# Altium schematic sheet DACModule.SchDoc
size A4; Date: 07.06.2021; Author: Mateusz Mróz; CompanyName: AGH; SheetNumber: 5; SheetTotal: 5
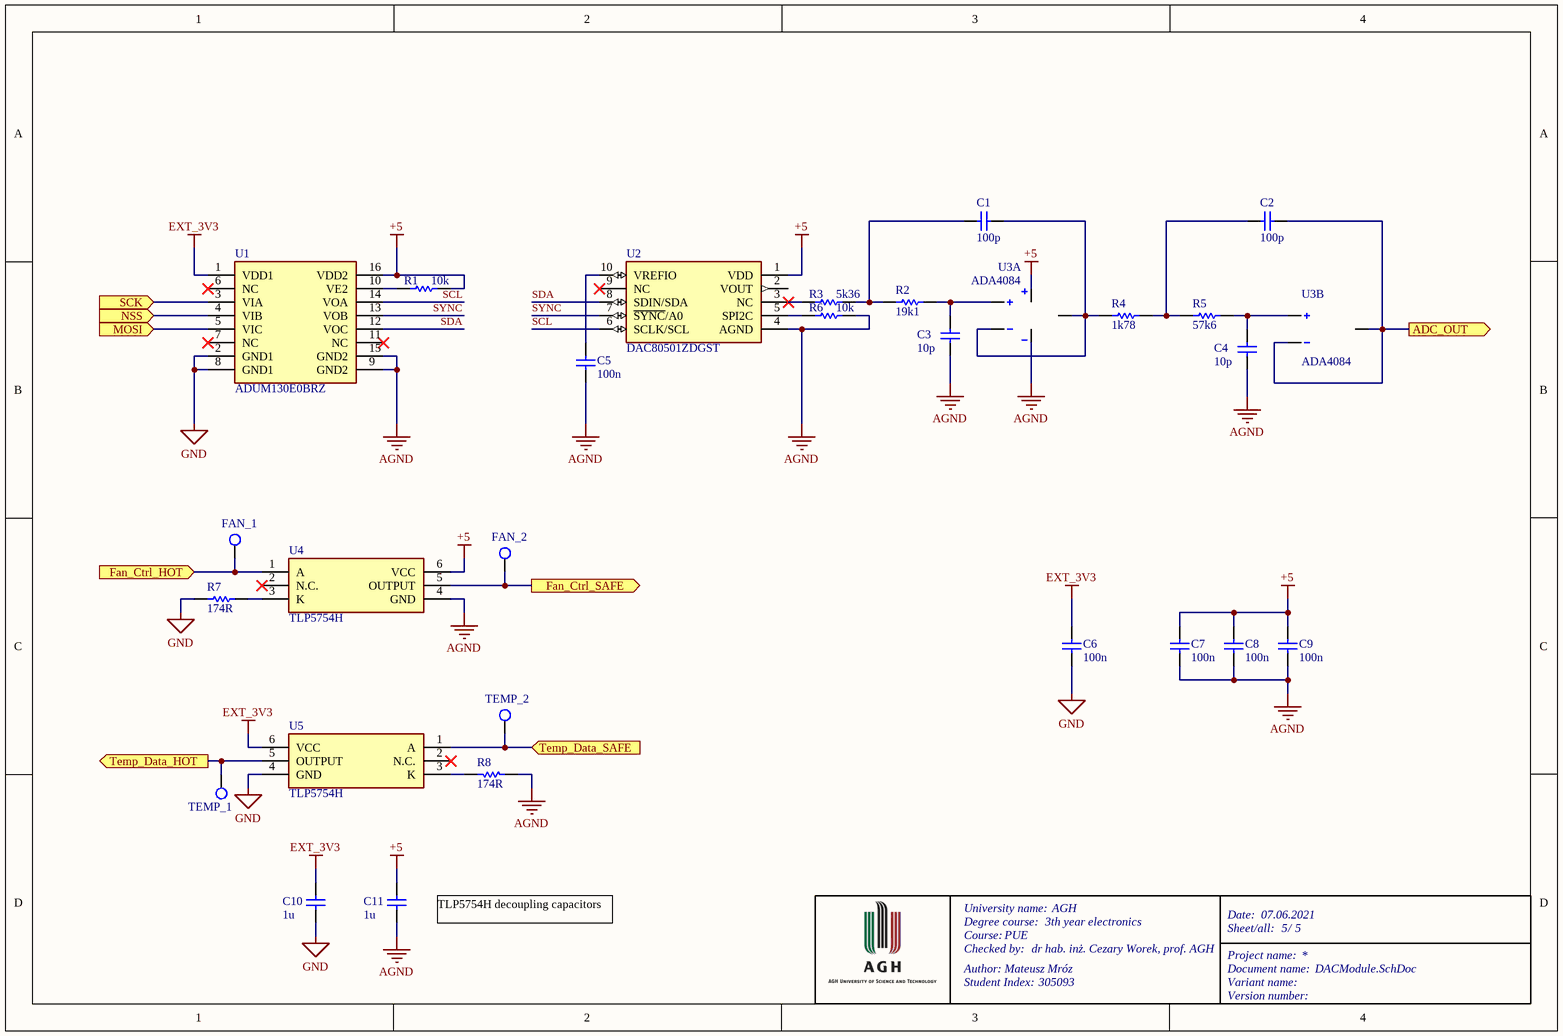
[diagram p0: DACModule.SchDoc]

## Parts
C1  100p  [Cap_0603_MD_outline]
C2  100p  [Cap_0603_MD_outline]
C3  10p  [Cap_0603_MD_outline]
C4  10p  [Cap_0603_MD_outline]
C5  100n  [Cap_0603_MD_outline]
C6  100n  [Cap_0603_MD_outline]
C7  100n  [Cap_0603_MD_outline]
C8  100n  [Cap_0603_MD_outline]
C9  100n  [Cap_0603_MD_outline]
C10  1u  [Cap_0805_MD_outline]
C11  1u  [Cap_0805_MD_outline]
R1  10k  [Res_0603_MD_outline]
R2  19k1  [Res_0603_MD_outline]
R3  5k36  [Res_0603_MD_outline]
R4  1k78  [Res_0603_MD_outline]
R5  57k6  [Res_0603_MD_outline]
R6  10k  [Res_0603_MD_outline]
R7  174R  [Res_0603_MD_outline]
R8  174R  [Res_0603_MD_outline]
TP1  FAN_1  [TP_SQ40]  (no BOM)
TP2  FAN_2  [TP_SQ40]  (no BOM)
TP3  TEMP_1  [TP_SQ40]  (no BOM)
TP4  TEMP_2  [TP_SQ40]  (no BOM)
U1  ADUM130E0BRZ  [SOIC127P600X175-16N]
U2  DAC80501ZDGST  [SOP50P490X110-10N]
U3  ADA4084  [SON50P300X300X85-9N-D]  (parts A,B,C of 3)
U4  TLP5754H  [SOIC127P1000X230-6N]
U5  TLP5754H  [SOIC127P1000X230-6N]

## Ports
ADC_OUT (out), Fan_Ctrl_HOT (in), Fan_Ctrl_SAFE (out), MOSI (in), NSS (in), SCK (in), Temp_Data_HOT (out), Temp_Data_SAFE (in)

## Nets
+5: C7.2 C8.2 C9.2 C11.2 R1.1 U1.16(VDD2) U2.1(VDD) U3.8(V+) U4.6(VCC)
AGND: C3.1 C4.1 C5.1 C7.1 C8.1 C9.1 C11.1 R6.1 R8.1 U1.9(GND2) U1.15(GND2) U2.4(AGND) U3.4(V-) U4.4(GND)
EXT_3V3: C6.2 C10.2 U1.1(VDD1) U5.6(VCC)
GND: C6.1 C10.1 R7.1 U1.2(GND1) U1.8(GND1) U5.4(GND)
ADC_OUT: C2.1 U3.6(-IN_B) U3.7(OUT_B) ; port ADC_OUT
Fan_Ctrl_HOT: TP1.1 U4.1(A) ; port Fan_Ctrl_HOT
Fan_Ctrl_SAFE: TP2.1 U4.5(OUTPUT) ; port Fan_Ctrl_SAFE
MOSI: U1.5(VIC) ; port MOSI
NSS: U1.4(VIB) ; port NSS
SCK: U1.3(VIA) ; port SCK
SCL: U1.14(VOA) U2.6(SCLK/SCL)
SDA: U1.12(VOC) U2.8(SDIN/SDA)
SYNC: U1.13(VOB) U2.7(~{SYNC}/A0)
Temp_Data_HOT: TP3.1 U5.5(OUTPUT) ; port Temp_Data_HOT
Temp_Data_SAFE: TP4.1 U5.1(A) ; port Temp_Data_SAFE
NetC1_1: C1.1 R4.1 U3.1(OUT_A) U3.2(-IN_A)
NetC1_2: C1.2 R2.1 R3.1
NetC2_2: C2.2 R4.2 R5.1
NetC3_2: C3.2 R2.2 U3.3(+IN_A)
NetC4_2: C4.2 R5.2 U3.5(+IN_B)
NetC5_2: C5.2 U2.10(VREFIO)
NetR1_2: R1.2 U1.10(VE2)
NetR3_2: R3.2 U2.3(NC)
NetR6_2: R6.2 U2.5(SPI2C)
NetR7_2: R7.2 U4.3(K)
NetR8_2: R8.2 U5.3(K)

Not connected (* = marked no-connect by the designer): U1 6(NC)* 7(NC)* 11(NC)*; U2 2(VOUT) 9(NC)*; U4 2(N.C.)*; U5 2(N.C.)*

## Notes on the sheet
- (near C11) TLP5754H decoupling capacitors
- University name:
- Degree course:
- 3th year electronics
- Date:
- Author:
- Student Index:
- Course:
- Checked by:
- PUE
- dr hab. inż. Cezary Worek, prof. AGH
- 305093
- Project name:
- Document name:
- Variant name:
- Sheet/all:
- /
- Version number:

## Library data of the parts
C1 C2 = Capacitor: MPN: GQM1875C2E101JB12D; Value: 100p; Package: 0603
C3 C4 = Capacitor: MPN: GRM1885C2E100JW07D; Value: 10p; Package: 0603
C5-C9 = Capacitor: MPN: GRM188R72A104KA35; Value: 100n; Package: 0603
C10 C11 = Capacitor: MPN: GRM219R7YA105KA12; Value: 1u; Package: 0805
R1 R6 = Resistor: MPN: CRCW060310K0FKEAC; Value: 10k; Package: 0603
R2 = Resistor: MPN: CRCW060319K1FKTA; Value: 19k1; Package: 0603
R3 = Resistor: MPN: CRCW06035K36FKEA; Value: 5k36; Package: 0603
R4 = Resistor: MPN: CRCW06031K78FKTA; Value: 1k78; Package: 0603
R5 = Resistor: MPN: CRCW060357K6FKEA; Value: 57k6; Package: 0603
R7 R8 = Resistor: MPN: CRCW0603174RFKEA; Value: 174R; Package: 0603
TP1-TP4 = TestPoint: Test point; HelpURL: *; MPN: *
  TP1: Value: FAN_1
  TP2: Value: FAN_2
  TP3: Value: TEMP_1
  TP4: Value: TEMP_2
U1 = ADUM130E0BRZ: Digital isolator; MPN: ADUM130E0BRZ
U2 = DAC80501ZDGST: DAC; Resolution: 16bit; MPN: DAC80501ZDGST
U3 = ADA4084-2ACPZ-R7: Op Amp; MPN: ADA4084-2ACPZ-R7
U4 U5 = TLP5754H: Optocoupler; MPN: TLP5754H(TP4,E